# Altium schematic sheet multiplier.SchDoc
size 431 x 279 mm; SheetNumber: 5; SheetTotal: 7
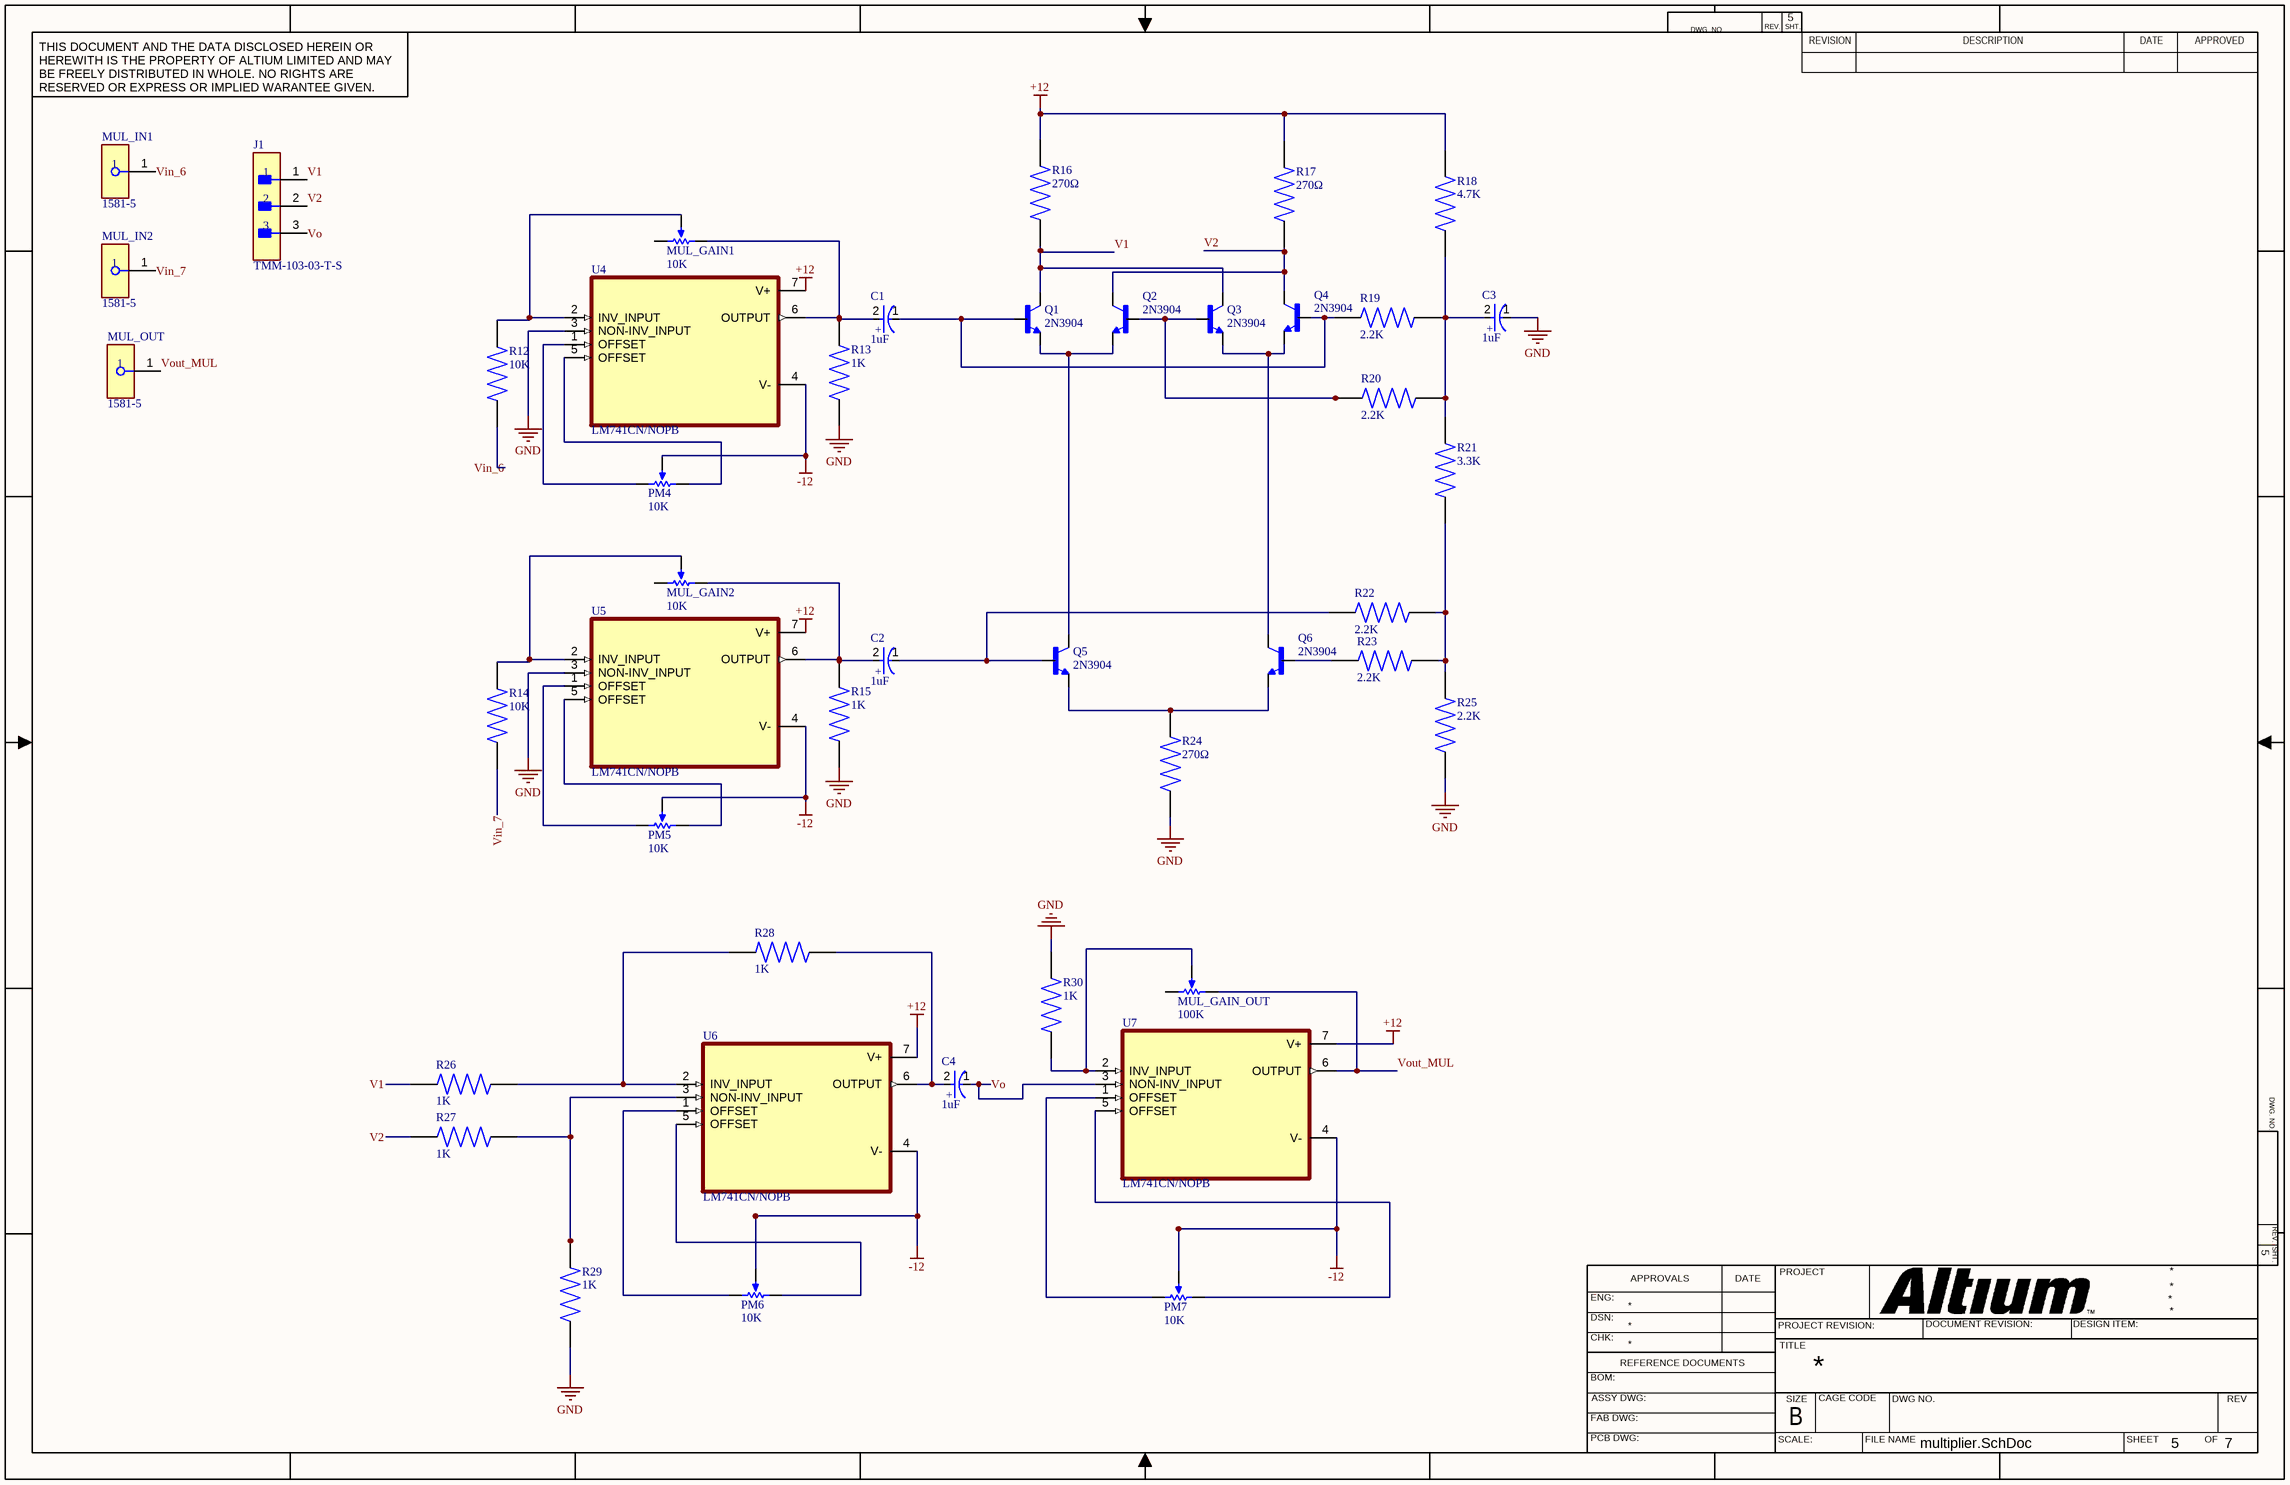
[diagram p0: multiplier.SchDoc]

## Parts
C1  1uF  [FP-ECA-2CHG010I-MFG]
C2  1uF  [FP-ECA-2CHG010I-MFG]
C3  1uF  [FP-ECA-2CHG010I-MFG]
C4  1uF  [FP-ECA-2CHG010I-MFG]
J1  TMM-103-03-T-S  [FP-TMM-103-03-T-S-MFG]
MUL_GAIN1  10K  [PCBComponent_1]
MUL_GAIN2  10K  [PCBComponent_1]
MUL_GAIN_OUT  100K  [PCBComponent_1]
MUL_IN1  1581-5  [FP-1581-5-MFG]
MUL_IN2  1581-5  [FP-1581-5-MFG]
MUL_OUT  1581-5  [FP-1581-5-MFG]
PM4  10K  [PCBComponent_1]
PM5  10K  [PCBComponent_1]
PM6  10K  [PCBComponent_1]
PM7  10K  [PCBComponent_1]
Q1  2N3904  [TO92254P460H750-3]
Q2  2N3904  [TO92254P460H750-3]
Q3  2N3904  [TO92254P460H750-3]
Q4  2N3904  [TO92254P460H750-3]
Q5  2N3904  [TO92254P460H750-3]
Q6  2N3904  [TO92254P460H750-3]
R12  10K  [RESAD1100W55L680D260]
R13  1K  [RESAD1100W55L680D260]
R14  10K  [RESAD1100W55L680D260]
R15  1K  [RESAD1100W55L680D260]
R16  270Ω  [RESAD1100W55L680D260]
R17  270Ω  [RESAD1100W55L680D260]
R18  4.7K  [RESAD1100W55L680D260]
R19  2.2K  [RESAD1100W55L680D260]
R20  2.2K  [RESAD1100W55L680D260]
R21  3.3K  [RESAD1100W55L680D260]
R22  2.2K  [RESAD1100W55L680D260]
R23  2.2K  [RESAD1100W55L680D260]
R24  270Ω  [RESAD1100W55L680D260]
R25  2.2K  [RESAD1100W55L680D260]
R26  1K  [RESAD1100W55L680D260]
R27  1K  [RESAD1100W55L680D260]
R28  1K  [RESAD1100W55L680D260]
R29  1K  [RESAD1100W55L680D260]
R30  1K  [RESAD1100W55L680D260]
U4  LM741CN/NOPB  [DIP794W45P254L959H508Q8]
U5  LM741CN/NOPB  [DIP794W45P254L959H508Q8]
U6  LM741CN/NOPB  [DIP794W45P254L959H508Q8]
U7  LM741CN/NOPB  [DIP794W45P254L959H508Q8]

## Nets
+12: R16.2 R17.2 R18.2 U4.7(V+) U5.7(V+) U6.7(V+) U7.7(V+)
-12: PM4.2(S) PM5.2(S) PM6.2(S) PM7.2(S) U4.4(V-) U5.4(V-) U6.4(V-) U7.4(V-)
GND: C3.1(C) R13.1 R15.1 R24.1 R25.1 R29.1 R30.1 U4.3(NON-INV_INPUT) U5.3(NON-INV_INPUT)
V1: J1.1 Q1.3(C) Q3.3(C) R16.1 R26.1
V2: J1.2 Q2.3(C) Q4.3(C) R17.1 R27.1
Vin_6: MUL_IN1.1 R12.1
Vin_7: MUL_IN2.1 R14.1
Vo: C4.1(C) J1.3 U7.3(NON-INV_INPUT)
Vout_MUL: MUL_GAIN_OUT.1(CCW) MUL_OUT.1 U7.6(OUTPUT)
NetC1_1: C1.1(C) Q1.2(B) Q4.2(B) R19.1
NetC1_2: C1.2(A) MUL_GAIN1.1(CCW) R13.2 U4.6(OUTPUT)
NetC2_1: C2.1(C) Q5.2(B) R22.1
NetC2_2: C2.2(A) MUL_GAIN2.1(CCW) R15.2 U5.6(OUTPUT)
NetC3_2: C3.2(A) R18.1 R19.2 R20.2 R21.2
NetC4_2: C4.2(A) R28.2 U6.6(OUTPUT)
NetMUL_GAIN1_2: MUL_GAIN1.2(S) R12.2 U4.2(INV_INPUT)
NetMUL_GAIN2_2: MUL_GAIN2.2(S) R14.2 U5.2(INV_INPUT)
NetMUL_GAIN_OUT_2: MUL_GAIN_OUT.2(S) R30.2 U7.2(INV_INPUT)
NetPM4_1: PM4.1(CCW) U4.5(OFFSET)
NetPM4_3: PM4.3(CW) U4.1(OFFSET)
NetPM5_1: PM5.1(CCW) U5.5(OFFSET)
NetPM5_3: PM5.3(CW) U5.1(OFFSET)
NetPM6_1: PM6.1(CCW) U6.5(OFFSET)
NetPM6_3: PM6.3(CW) U6.1(OFFSET)
NetPM7_1: PM7.1(CCW) U7.5(OFFSET)
NetPM7_3: PM7.3(CW) U7.1(OFFSET)
NetQ1_1: Q1.1(E) Q2.1(E) Q5.3(C)
NetQ2_2: Q2.2(B) Q3.2(B) R20.1
NetQ3_1: Q3.1(E) Q4.1(E) Q6.3(C)
NetQ5_1: Q5.1(E) Q6.1(E) R24.2
NetQ6_2: Q6.2(B) R23.1
NetR21_1: R21.1 R22.2 R23.2 R25.2
NetR26_2: R26.2 R28.1 U6.2(INV_INPUT)
NetR27_2: R27.2 R29.2 U6.3(NON-INV_INPUT)

Not connected (* = marked no-connect by the designer): MUL_GAIN1 3(CW); MUL_GAIN2 3(CW); MUL_GAIN_OUT 3(CW)

## Notes on the sheet
- DWG. NO.
- REV.
- SHT.
- THIS DOCUMENT AND THE DATA DISCLOSED HEREIN OR HEREWITH IS THE PROPERTY OF ALTIUM LIMITED AND MAY BE FREELY DISTRIBUTED IN WHOLE. NO RIGHTS ARE RESERVED OR EXPRESS OR IMPLIED WARANTEE GIVEN.
- REVISION
- DESCRIPTION
- DATE
- APPROVED
- ENG:
- APPROVALS
- PROJECT
- DSN:
- CHK:
- REFERENCE DOCUMENTS
- PROJECT REVISION:
- TITLE
- DOCUMENT REVISION:
- DESIGN ITEM:
- BOM:
- FAB DWG:
- PCB DWG:
- ASSY DWG:
- SCALE:
- SIZE
- B
- CAGE CODE
- FILE NAME
- DWG NO.
- SHEET
- OF
- REV
- (in symbol CMP-05427-002176-1) +

## Library data of the parts
C1-C4 = CMP-05427-002176-1: CAP ALUM 1UF 20% 160V RADIAL; Lead/Base Style: Straight; Ripple Current: 17mA; Life (Hours): 2000Hour; Voltage Rating (DC): 160V; Max Operating Temperature: 105°C; Radiation Hardening: No; Min Operating Temperature: -25°C; Packaging: Ammo Pack; Series: NHG; Capacitance: 1uF; Height - Seated (Max): 0.48inch; Lead Pitch: 2.5mm; Diameter: 6.3mm; Length: 11.2mm; Package Quantity: 2000; Termination: Radial; RoHS Compliant: Yes; Voltage Rating: 160V; Tolerance: 20%; Height: 11.2mm; Case/Package: Radial; Mount: Through Hole
J1 = CMP-02766-001695-1: CONN HEADER VERT 3POS 2MM; Gender: Male; Number of Positions: 3; Max Current Rating: 3.9A; Max Voltage Rating (AC): 500V; Packaging: Bulk; RoHS Compliant: Yes; Mount: Through Hole; Length: 6mm; Contact Type: Male Pin; Package Quantity: 1; Depth: 1.97mm; Contact Material: Bronze; Insulation Material: Polymer; Series: TMM; Contact Plating: Tin; Fastening Type: Pull; Housing Color: Black; Pitch: 2mm; Termination: Solder; Contact Mating Length: 0.157inch; Min Operating Temperature: -55°C; REACH SVHC: No SVHC; Orientation: Straight; Number of Rows: 1; Color: Black; Insulation Color: Black; Connector Type: Header; Radiation Hardening: No; Number of Contacts: 3; Lead Free: Lead Free; Contact Finish - Mating: TIN; Max Operating Temperature: 105°C; Housing Material: Polymer; Contact Shape: Square
MUL_GAIN1 MUL_GAIN2 MUL_GAIN_OUT PM4-PM7 = Component_1
MUL_IN1 MUL_IN2 MUL_OUT = CMP-73906-000011-1: CONN BANANA JACK TURRET GREEN; Body Material: PC; Number of Contacts: 1; Max Current Rating: 15A; Voltage Rating (AC): 30V; Insulation: Mating End Insulated; Voltage Rating: 2.5kV; Voltage Rating (DC): 60V; Gender: Female; Height: 0.25inch; Mount: Panel; RoHS Compliant: Yes; Length: 1.22inch; Orientation: Straight; Diameter: 4.22mm; Lead Free: Lead Free; Package Quantity: 1; Termination: Turret; Current Rating: 15A; Packaging: Bag; Series: 1581; REACH SVHC: No SVHC; Number of Positions: 1; Contact Plating: Tin; Housing Color: Green; Contact Material: Brass; Insulation Material: Polycarbonate; Weight: 0.126lb; Number of Ports: 1; Color: Green; Housing Material: Polycarbonate; Width: 4inch
Q1-Q6 = 2N3904: BJT, TO-92, 40V, 200mA, NPN, 0.625W, 150Â°C; MF: Diotec Semiconductor; SnapEDA_Link: https://www.snapeda.com/parts/2N3904/Diotec/view-part/?ref=snap; Package: TO-92 Diotec; Value: *; MP: 2N3904; Check_prices: https://www.snapeda.com/parts/2N3904/Diotec/view-part/?ref=eda
R12-R30 = MFR-25FBF52-1K: 1.07 kOhms Â±1% 0.25W, 1/4W Through Hole Resistor Axial - Metal Film; MF: Yageo; SnapEDA_Link: https://www.snapeda.com/parts/MFR-25FBF52-1K/Yageo/view-part/?ref=snap; Package: RADIAL-2 YAGEO; Value: *; MP: MFR-25FBF52-1K; Check_prices: https://www.snapeda.com/parts/MFR-25FBF52-1K/Yageo/view-part/?ref=eda
U4-U7 = LM741CN/NOPB: Single, 44-V, 1-MHz operational amplifier; MF: Texas Instruments; SnapEDA_Link: https://www.snapeda.com/parts/LM741CN/NOPB/Texas+Instruments/view-part/?ref=snap; Package: PDIP-8 Texas; Value: *; MP: LM741CN/NOPB; Check_prices: https://www.snapeda.com/parts/LM741CN/NOPB/Texas+Instruments/view-part/?ref=eda